# EAGLE design rcstick-f (EAGLE 9.3.0)
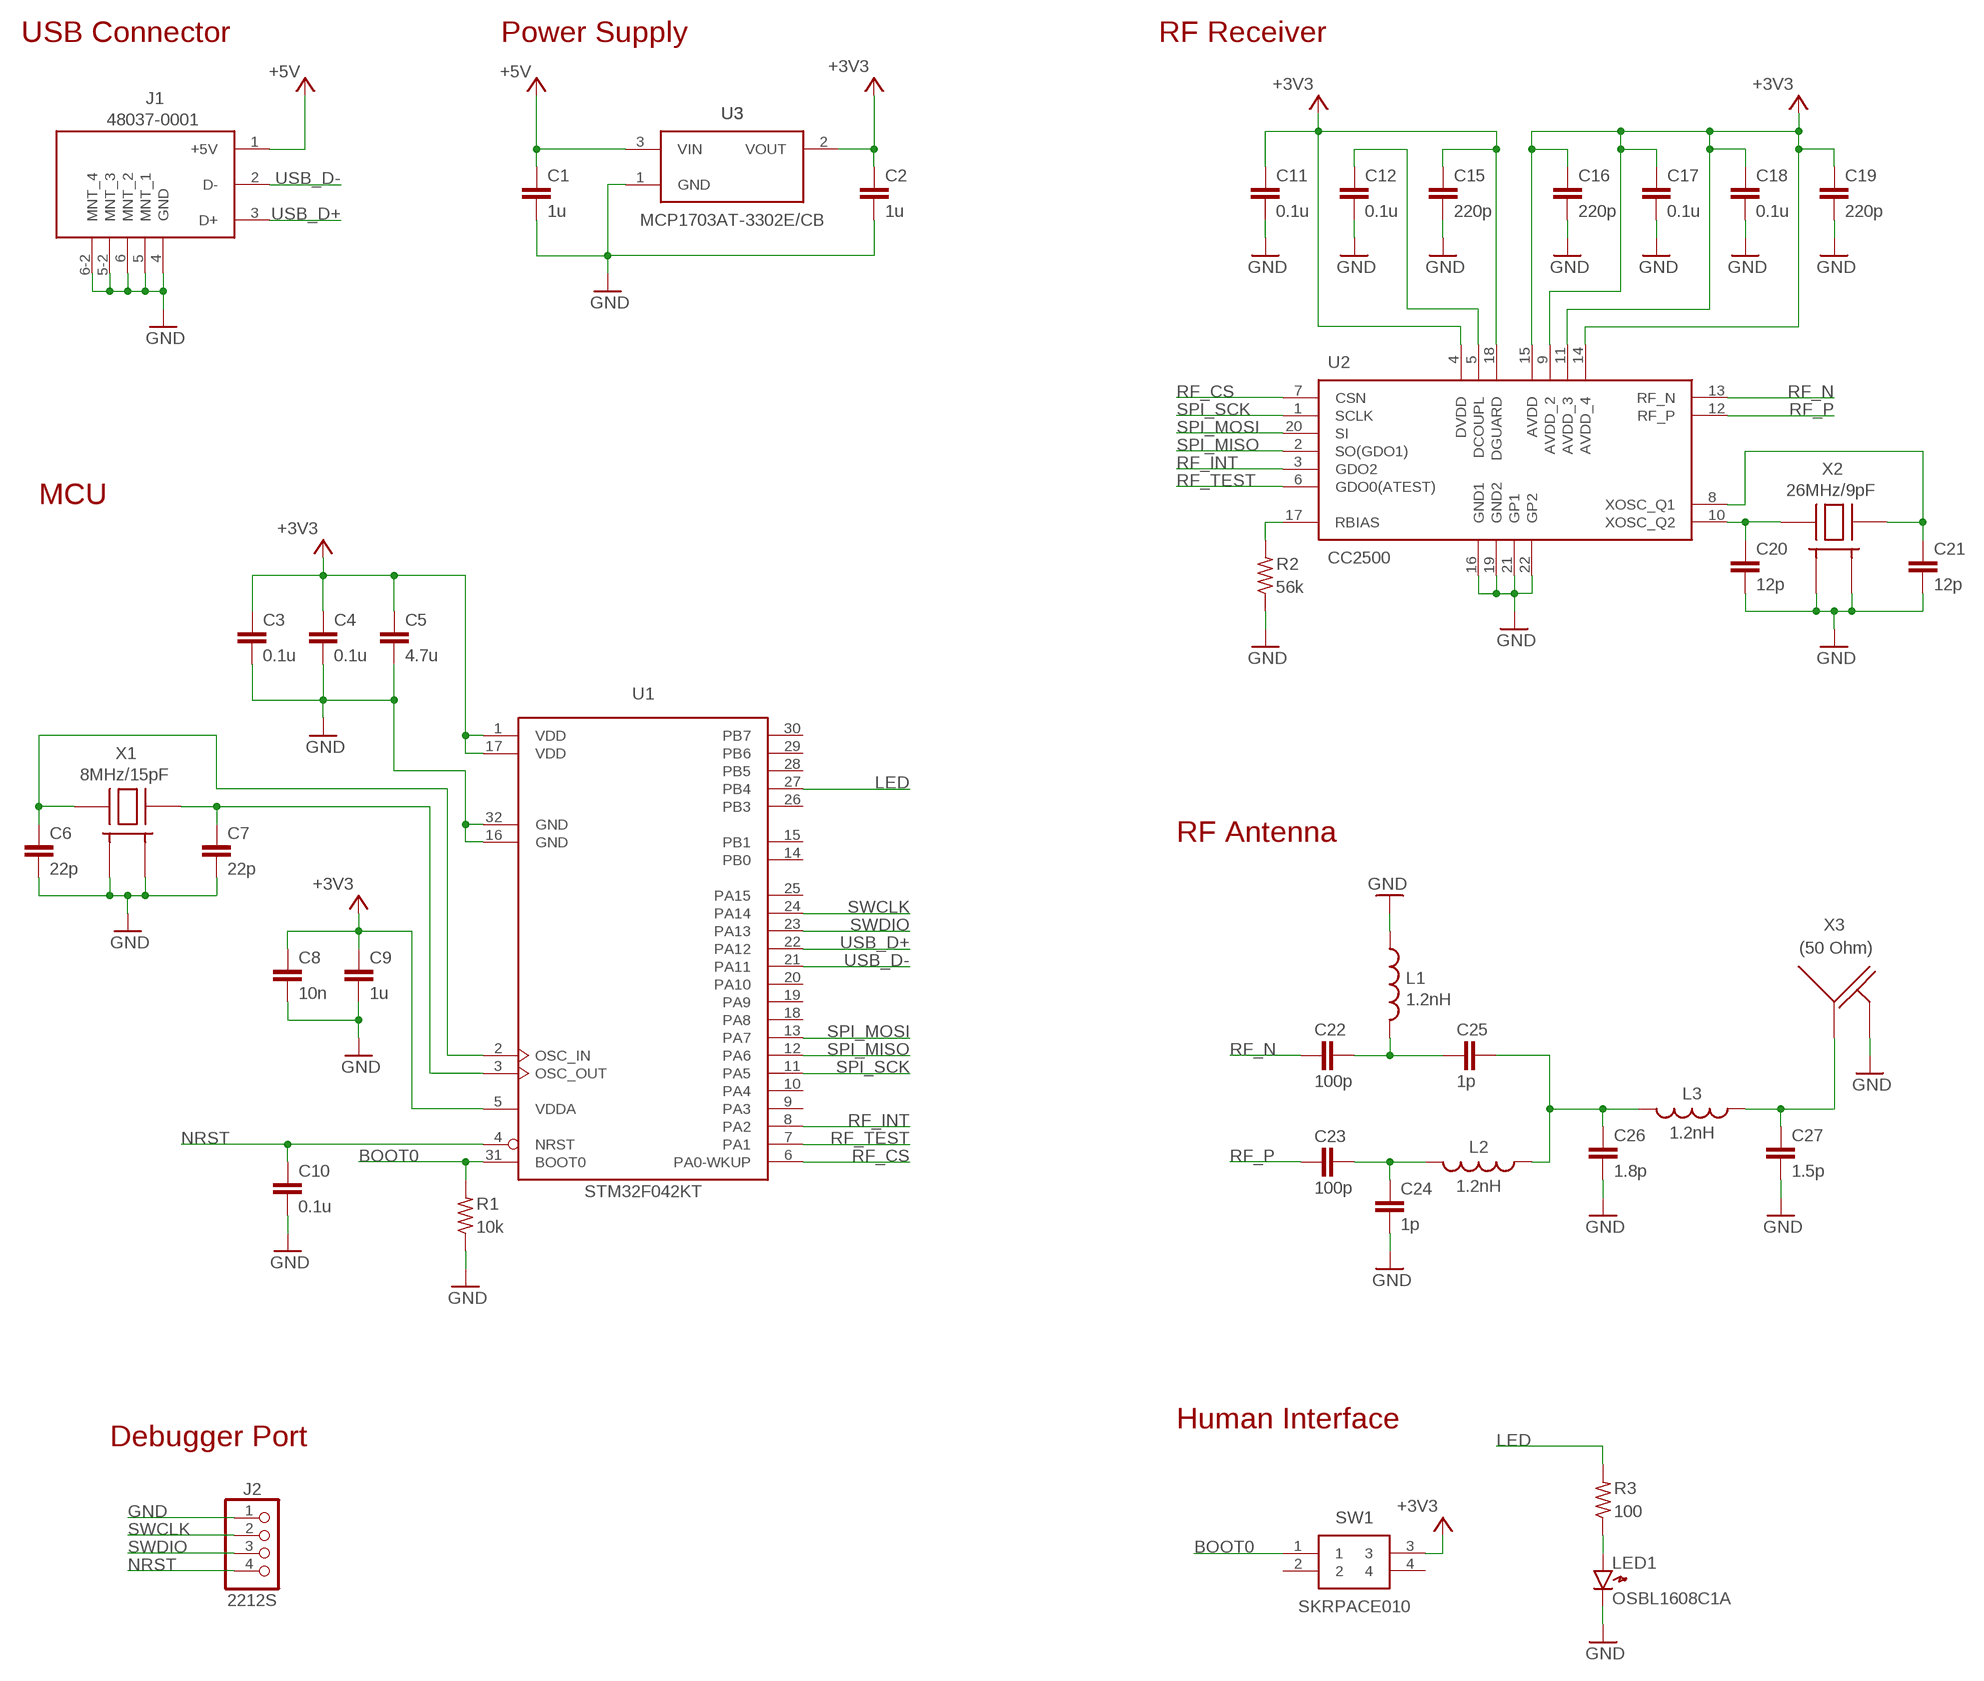
[diagram p0: schematic, sheet 1]

## Parts
C1  1u  RCL_C-EUC0402-HS  [RCL_C0402_HS]
C2  1u  RCL_C-EUC0402-HS  [RCL_C0402_HS]
C3  0.1u  RCL_C-EUC0402-HS  [RCL_C0402_HS]
C4  0.1u  RCL_C-EUC0402-HS  [RCL_C0402_HS]
C5  4.7u  RCL_C-EUC0402-HS  [RCL_C0402_HS]
C6  22p  RCL_C-EUC0402-HS  [RCL_C0402_HS]
C7  22p  RCL_C-EUC0402-HS  [RCL_C0402_HS]
C8  10n  RCL_C-EUC0402-HS  [RCL_C0402_HS]
C9  1u  RCL_C-EUC0402-HS  [RCL_C0402_HS]
C10  0.1u  RCL_C-EUC0402-HS  [RCL_C0402_HS]
C11  0.1u  RCL_C-EUC0402-HS  [RCL_C0402_HS]
C12  0.1u  RCL_C-EUC0402-HS  [RCL_C0402_HS]
C15  220p  RCL_C-EUC0402-HS  [RCL_C0402_HS]
C16  220p  RCL_C-EUC0402-HS  [RCL_C0402_HS]
C17  0.1u  RCL_C-EUC0402-HS  [RCL_C0402_HS]
C18  0.1u  RCL_C-EUC0402-HS  [RCL_C0402_HS]
C19  220p  RCL_C-EUC0402-HS  [RCL_C0402_HS]
C20  12p  RCL_C-EUC0402-HS  [RCL_C0402_HS]
C21  12p  RCL_C-EUC0402-HS  [RCL_C0402_HS]
C22  100p  RCL_C-EUC0402-HS  [RCL_C0402_HS]
C23  100p  RCL_C-EUC0402-HS  [RCL_C0402_HS]
C24  1p  RCL_C-EUC0402-HS  [RCL_C0402_HS]
C25  1p  RCL_C-EUC0402-HS  [RCL_C0402_HS]
C26  1.8p  RCL_C-EUC0402-HS  [RCL_C0402_HS]
C27  1.5p  RCL_C-EUC0402-HS  [RCL_C0402_HS]
J1  MOLEX_48037-0001  [MOLEX_48037-0001_1]
J2  2212S  CONNECTOR_STD-PINHD-1X4  [CONNECTOR_STD-1X4]
L1  1.2nH  RCL_L-USL0402-HS  [RCL_L0402_HS]
L2  1.2nH  RCL_L-USL0402-HS  [RCL_L0402_HS]
L3  1.2nH  RCL_L-USL0402-HS  [RCL_L0402_HS]
LED1  OSBL1608C1A  LED1608  [LED1608]
R1  10k  RCL_R-US_R0402-HS  [RCL_R0402_HS]
R2  56k  RCL_R-US_R0402-HS  [RCL_R0402_HS]
R3  100  RCL_R-US_R0402-HS  [RCL_R0402_HS]
SW1  SKRPACE010  [SMT(4.2X3.2)]
U1  STM32F042KT  [LQFP32-M]
U2  CC2500  CC2500-HS  [CC2500-RTY1_CC2500-HS]
U3  MCP1703AT-3302E/CB  LDO-REGULATOR  [SOT23]
X1  8MHz/15pF  CRYSTAL3225HS  [CRYSTAL3225-HS]
X2  26MHz/9pF  CRYSTAL3225HS  [CRYSTAL3225-HS]
X3  (50 Ohm)  2.4GHZ-INVERED-FLARGE-FLIP  [2.4GHZ-INVERTED-F-LARGE-FLIP]

## Nets
+3V3 [pwr]: C2.1 C3.1 C4.1 C5.1 C8.1 C9.1 C11.1 C15.1 C16.1 C17.1 C18.1 C19.1 SW1.3 U1.1(VDD) U1.5(VDDA) U1.17(VDD) U2.4(DVDD) U2.9(AVDD_2) U2.11(AVDD_3) U2.14(AVDD_4) U2.15(AVDD) U2.18(DGUARD) U3.2(VOUT)
+5V [pwr]: C1.1 J1.1(+5V) U3.3(VIN)
BOOT0: R1.2 SW1.1 U1.31(BOOT0)
DCOUPL: C12.1 U2.5(DCOUPL)
GND [gnd]: C1.2 C2.2 C3.2 C4.2 C5.2 C6.2 C7.2 C8.2 C9.2 C10.2 C11.2 C12.2 C15.2 C16.2 C17.2 C18.2 C19.2 C20.2 C21.2 C24.2 C26.2 C27.2 J1.4(GND) J1.5(MNT_1) J1.5-2(MNT_3) J1.6(MNT_2) J1.6-2(MNT_4) J2.1 L1.1 LED1.K R1.1 R2.1 U1.16(GND) U1.32(GND) U2.16(GND1) U2.19(GND2) U2.21(GP1) U2.22(GP2) U3.1(GND) X1.2(GND_1) X1.4(GND_2) X2.2(GND_1) X2.4(GND_2) X3.2(GND)
LED: R3.2 U1.27(PB4)
N$1: LED1.A R3.1
N$5: C22.2 C25.1 L1.2
N$9: C23.2 C24.1 L2.2
N$10: C25.2 C26.1 L2.1 L3.2
N$11: C27.1 L3.1 X3.1(ANT)
NRST: C10.1 J2.4 U1.4(NRST)
OSC_IN: C6.1 U1.2(OSC_IN) X1.1(HOT_1)
OSC_OUT: C7.1 U1.3(OSC_OUT) X1.3(HOT_2)
RBIAS: R2.2 U2.17(RBIAS)
RF_CS: U1.6(PA0-WKUP) U2.7(CSN)
RF_INT: U1.8(PA2) U2.3(GDO2)
RF_N: C22.1 U2.13(RF_N)
RF_P: C23.1 U2.12(RF_P)
RF_TEST: U1.7(PA1) U2.6(GDO0(ATEST))
SPI_MISO: U1.12(PA6) U2.2(SO(GDO1))
SPI_MOSI: U1.13(PA7) U2.20(SI)
SPI_SCK: U1.11(PA5) U2.1(SCLK)
SWCLK: J2.2 U1.24(PA14)
SWDIO: J2.3 U1.23(PA13)
USB_D+: J1.3(D+) U1.22(PA12)
USB_D-: J1.2(D-) U1.21(PA11)
XOSC1: C21.1 U2.8(XOSC_Q1) X2.3(HOT_2)
XOSC2: C20.1 U2.10(XOSC_Q2) X2.1(HOT_1)
Unconnected: SW1.2 SW1.4 U1.9(PA3) U1.10(PA4) U1.14(PB0) U1.15(PB1) U1.18(PA8) U1.19(PA9) U1.20(PA10) U1.25(PA15) U1.26(PB3) U1.28(PB5) U1.29(PB6) U1.30(PB7)

## Notes on the sheet
- USB Connector | Power Supply | RF Receiver
- MCU
- RF Antenna
- Human Interface
- Debugger Port

## Library data of the parts
C1-C12 C15-C27 = gen-discrete3:RCL_C-EU: CAPACITOR, European symbol
J1 = Molex - 48037-0001:MOLEX_48037-0001: Universal Serial Bus (USB) Shielded I/O Plug, Type A, Right Angle, Through Hole, 0.76µm Gold (Au) Plating, PCB Thickness 1.20mm-1.60mm, Lead-Free
J2 = connector2:CONNECTOR_STD-PINHD-1X4
L1-L3 = gen-discrete3:RCL_L-US: INDUCTOR, American symbol
LED1 = gen-discrete:LED: Generic LEDs
R1-R3 = gen-discrete3:RCL_R-US_: RESISTOR, American symbol
SW1 = SKRPACE010:SKRPACE010: Tactile Switches 4.2x3.2x2.5mm 260gf Source: Datasheet <http://www.alps.com/prod/info/E/HTML/Tact/SurfaceMount/SKRP/SKRPACE010.html>; ARROW_PART_NUMBER: SKRPACE010; DESCRIPTION: Tactile Switches 4.2x3.2x2.5mm 260gf; HEIGHT: mm; MANUFACTURER_NAME: ALPS; MANUFACTURER_PART_NUMBER: SKRPACE010
U1 = stm32:STM32F042K*T
U2 = CC2500:CC2500: RF Transceiver Source: Datasheet
U3 = SOT23_Module:LDO-REGULATOR
X1 X2 = CRYSTAL3225:CRYSTAL3225: Crystals 3225
X3 = antenna:2.4GHZ-INVERED-F

## Net classes
1 gnd: width 0.5 mm, drill 0.3 mm
2 pwr: width 0.2 mm, drill 0.3 mm

## Board
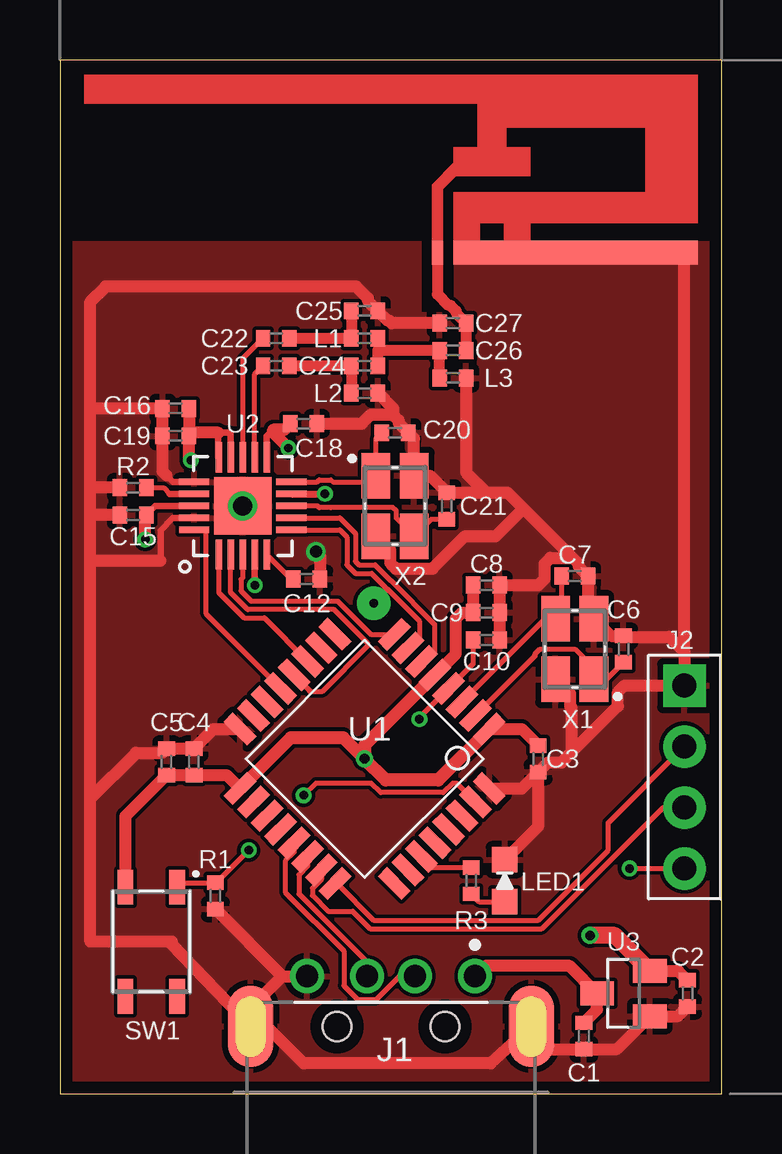
[diagram p1: board, top side]
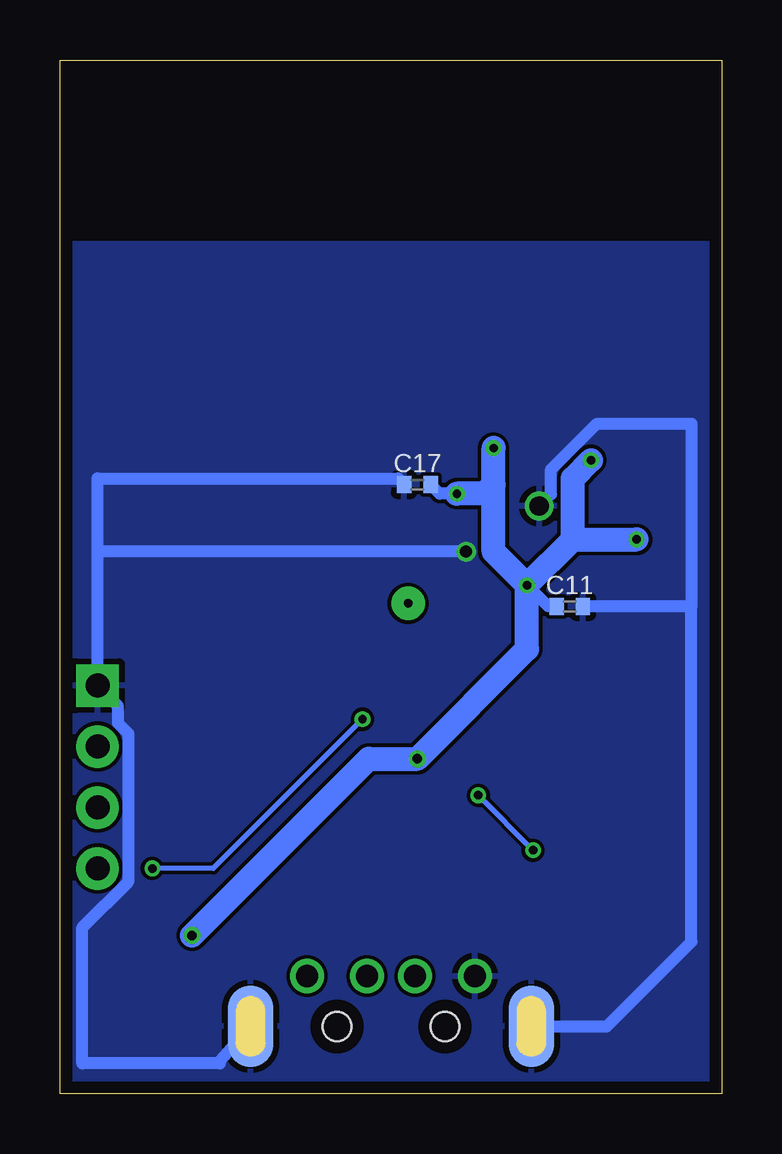
[diagram p2: board, bottom side, seen from below]

Size 27.6 x 43.1 mm. Coordinates in mm from the lower left corner, seen from the top.
Outline: 0,0 27.6,0 27.6,43.1 0,43.1 0,0
Copper layers (1*16): Top 0.035mm / dielectric 1.6mm / Bottom 0.035mm
Design rules "Elecrow_2-layer_PCB_eagle_rule": minimum track width 6mil, minimum drill 12mil, track to track 6mil, track to pad 6mil, pad to pad 6mil, via to via 8mil, smd to smd 0mil, copper to edge 20mil, drill to drill 10mil, minimum pad ring 6mil, minimum via ring 6mil, stop-mask expansion 0mil, vias tented up to drill 100mil, thermal gap 10mil

### Footprints (pad centres in the part's own frame; a part is rotated, then mirrored left to right if it is on the bottom)
RCL_C0402_HS = smd 0.6 x 0.7: 1 -0.55,0; 2 0.55,0
MOLEX_48037-0001_1 = drill 0.93 pad 1.42: 1 3.5,10.5; 2 1,10.5; 3 -1,10.5; 4 -3.5,10.5 | smd 1.9 x 3.4: 5 -5.85,8.4; 6 5.85,8.4 | smd 1.9 x 3.4 bottom: 5-2 -5.85,8.4; 6-2 5.85,8.4 | hole 1.2: -2.25,8.4; 2.25,8.4
CONNECTOR_STD-1X4 = drill 1 pad 1.778 square: 1 -6.35,0 | drill 1 pad 1.778: 2 -3.81,0; 3 -1.27,0; 4 1.27,0
RCL_L0402_HS = smd 0.6 x 0.7: 1 -0.55,0; 2 0.55,0
LED1608 = smd 1.05 x 1.08: A -0.875,0; K 0.875,0
RCL_R0402_HS = smd 0.6 x 0.7: 1 -0.55,0; 2 0.55,0
SMT(4.2X3.2) = smd 1.45 x 0.65: 1 -2.275,1.075; 2 2.275,1.075; 3 -2.275,-1.075; 4 2.275,-1.075
LQFP32-M = smd 0.54 x 1.4: 1 -2.8,-4.55; 2 -2,-4.55; 3 -1.2,-4.55; 4 -0.4,-4.55; 5 0.4,-4.55; 6 1.19,-4.55; 7 1.99,-4.55; 8 2.79,-4.55; 17 2.8,4.55; 18 2,4.55; 19 1.2,4.55; 20 0.4,4.55; 21 -0.4,4.55; 22 -1.2,4.55; 23 -2,4.55; 24 -2.8,4.55 | smd 1.4 x 0.54: 9 4.55,-2.8; 10 4.55,-2; 11 4.55,-1.2; 12 4.55,-0.4; 13 4.55,0.4; 14 4.55,1.2; 15 4.55,2; 16 4.55,2.8; 25 -4.55,2.8; 26 -4.55,2; 27 -4.55,1.2; 28 -4.55,0.4; 29 -4.55,-0.4; 30 -4.55,-1.2; 31 -4.55,-2; 32 -4.55,-2.8
CC2500-RTY1_CC2500-HS = smd 1.26 x 0.28: 1 -2.03,1; 2 -2.03,0.5; 3 -2.03,0; 4 -2.03,-0.5; 5 -2.03,-1; 11 2.03,-1; 12 2.03,-0.5; 13 2.03,0; 14 2.03,0.5; 15 2.03,1 | smd 0.28 x 1.26: 6 -1,-2.03; 7 -0.5,-2.03; 8 0,-2.03; 9 0.5,-2.03; 10 1,-2.03; 16 1,2.03; 17 0.5,2.03; 18 0,2.03; 19 -0.5,2.03; 20 -1,2.03 | smd 2.4 x 2.4: 21 0,0 | drill 0.8: 22 0,0
SOT23 = smd 1 x 1.4: 1 -0.95,-1.1; 2 0.95,-1.1; 3 0,1.1
CRYSTAL3225-HS = smd 1.9 x 1.2: 1 -1.26,-0.8; 2 1.26,-0.8; 3 1.26,0.8; 4 -1.26,0.8
2.4GHZ-INVERTED-F-LARGE-FLIP = smd 0.46 x 1: 1 -10.86,-0.5 | smd 10.18 x 1: 2 -5.09,-0.5

### Placement (x,y rotation side)
C1  21.84,2.41 270 top
C2  26.16,4.19 270 top
C3  19.94,13.97 270 top
C4  5.59,13.84 90 top
C5  4.45,13.84 90 top
C6  23.5,18.54 90 top
C7  21.46,21.59 0 top
C8  17.78,21.21 0 top
C9  17.78,20.07 0 top
C10  17.78,18.92 0 top
C11  6.35,20.32 0 bottom
C12  10.29,21.46 0 top
C15  3.05,24.13 180 top
C16  4.83,28.57 180 top
C17  12.7,25.4 180 bottom
C18  10.16,27.94 0 top
C19  4.83,27.43 180 top
C20  13.97,27.56 0 top
C21  16.13,24.51 90 top
C22  9.02,31.5 0 top
C23  9.02,30.35 0 top
C24  12.7,29.21 0 top
C25  12.7,31.5 0 top
C26  16.38,29.84 0 top
C27  16.38,32.13 180 top
J1  13.8,-5.59 0 top
J2  26.04,10.67 270 top
L1  12.7,32.64 180 top
L2  12.7,30.35 180 top
L3  16.38,30.99 180 top
LED1  18.54,8.89 90 top
R1  6.48,8.26 90 top
R2  3.05,25.27 0 top
R3  17.14,8.89 90 top
SW1  3.81,6.35 270 top
U1  12.7,13.97 135 top
U2  7.62,24.51 90 top
U3  23.5,4.19 90 top
X1  21.46,18.54 90 top
X2  13.97,24.51 270 top
X3  26.59,35.57 0 top

### Tracks (layer width: path | path; a pad name or v marks a point on that pad's centre or on a via)
+3V3  (via drill 0.35, 0.4)
  Top 0.27: U2.15 6.6,26.56 6.6,27.56 7.11,27.56 7.12,27.55 U2.14 | U2.11 8.62,27.42 8.89,27.69 | U2.18 3.98,24.51 C15.1 | U2.4 v8.12,21.22 v8.13,21.21
  Top 0.3: U2.9 v11.04,25.01 v11.05,25.02
  Top 0.5: U3.2 25.76,5.14 C2.1 | U1.17 6.94,13.29 C4.1 C5.1 2.73,11.58 SW1.3 | U1.1 19.25,15.21 C3.1 | U1.5 16.51,18.35 16.51,19.81 16.76,20.07 C9.1 C8.1 | C16.1 C19.1 | v5.46,26.42 5.38,26.5 C19.1 | v3.56,23.11 3.56,24.09 C15.1 | v9.53,26.92 8.89,27.56 8.89,27.69 9.36,27.69 C18.1 | 6.6,27.56 5.5,27.56 C19.1
  Top 0.54: U1.5 12.7,14.54 v12.7,13.97 | U1.1 15.77,13.08 13.59,13.08 v12.7,13.97 | U1.17 9.63,14.86 11.81,14.86 v12.7,13.97
  Top 0.7: U3.2 23.13,6.6 v22.1,6.6
  Bottom 0.5: v11.05,25.02 11.77,25.02 C17.1 | C11.1 7.24,20.32 v8.13,21.21
  Bottom 1: v22.1,6.6 14.73,13.97 v12.7,13.97 8.13,18.54 v8.13,21.21 | v8.13,21.21 6.22,23.11 | 6.22,23.11 v3.56,23.11 | 6.22,23.11 6.22,25.65 v5.46,26.42 | v8.13,21.21 9.53,22.61 9.53,25.4 | 9.53,25.4 v9.53,26.92 | 9.53,25.4 9.91,25.02 v11.05,25.02
+5V
  Top 0.5: C1.1 22.39,3.51 U3.3 21.25,5.33 17.72,5.33 J1.1
BOOT0  (via drill 0.35)
  Top 0.2: U1.31 16.54,12.95 16.38,12.95 15.99,12.56 13.37,12.56 12.98,12.95 10.67,12.95 v10.16,12.45 | v7.87,10.16 6.52,8.8 R1.2 5.07,8.8 SW1.1
  Bottom 0.2: v10.16,12.45 v7.87,10.16
DCOUPL
  Top 0.2: U2.5 9.64,21.46 C12.1
GND  (via drill 0.5)
  Top 0.27: U2.16 4.71,25.51 4.45,25.78 | U2.19 4.71,24.01 4.19,23.5 4.19,22.23
  Top 0.5: C2.2 25.76,3.24 U3.1 23.22,1.86 C1.2 20.45,1.86 J1.6 17.96,1.27 10.16,1.27 8.62,2.81 J1.5 | C10.2 C9.2 C8.2 19.94,21.21 20.21,21.48 20.21,22.11 20.45,22.34 21.38,22.34 | LED1.K 19.94,11.16 C3.2 | U1.32 19.25,12.73 C3.2 | C3.2 20.34,13.82 20.92,13.82 21.33,14.23 | U1.16 6.4,15.21 C4.2 C5.2 4.28,14.22 3.17,14.22 1.27,12.32 | R1.1 9.27,4.91 | 9.27,4.91 J1.4 | 1.27,12.32 1.27,6.35 4.66,6.35 4.66,6.25 J1.5 | 26.04,18.41 25.4,19.05 23.54,19.05 C6.2 22.97,19.09 X1.2 22.01,20.05 C7.2 21.61,21.99 21.61,22.11 21.38,22.34 | 26.04,18.41 J2.1 23.54,17.02 23.27,16.75 23.27,16.16 21.33,14.23 | 1.27,12.32 1.27,22.23 | 1.27,22.23 1.27,24.13 | 1.27,24.13 1.27,25.27 | 1.27,25.27 1.27,28.7 | X1.4 21.26,16.68 21.26,16.16 21.33,16.1 21.33,14.23 | 4.19,22.23 1.27,22.23 | 1.27,28.7 1.4,28.57 C16.2 C19.2 4.28,25.95 4.45,25.78 | R2.1 1.27,25.27 | C15.2 1.27,24.13 | 13.89,28.31 12.95,28.31 12.58,27.94 C18.2 | 13.89,28.31 14.12,28.08 14.12,27.96 C20.2 14.77,27.31 X2.4 15.42,25.77 C21.2 17.78,25.06 | 19.32,24.4 18.66,25.06 17.78,25.06 | 19.32,24.4 21.38,22.34 | 19.32,24.4 18.17,23.25 16.89,23.25 15.54,21.9 14,21.9 13.77,22.13 13.77,22.65 X2.2 | 1.27,28.7 1.27,33.02 1.91,33.66 12.35,33.66 12.85,33.16 12.85,33.04 L1.1 13.64,32.25 13.72,32.25 13.83,32.13 C27.2 | C26.2 16.93,25.91 17.78,25.06 | C24.2 13.89,28.57 13.89,28.31 | v10.67,22.61 10.84,22.44 C12.2 | 26.04,18.41 26.04,34.92 25.64,35.32 21.75,35.32 X3.2 | J1.5 8.1,3.74 9.27,4.91
  Bottom 0.5: 1.27,20.32 1.27,6.35 4.81,2.81 J1.5 | 1.27,20.32 C11.2 | 26.04,22.61 J2.1 25.18,16.17 25.18,15.46 24.74,15.01 24.74,8.86 26.67,6.94 26.67,1.27 20.94,1.27 20.94,1.37 J1.6 | 26.04,22.61 26.04,25.65 13.5,25.65 C17.2 | U2.22 7.12,25.01 7.12,26.03 5.21,27.94 1.27,27.94 1.27,20.32 | v10.67,22.61 26.04,22.61
  pour Bottom: 0,-1.27 -1.27,0 -1.27,35.56 29.21,35.56 29.21,0 27.94,-1.27
  pour Top: 27.69,35.56 16.52,35.56 16.52,32.49 14.99,32.49 14.99,35.56 0,35.56 0,0 27.56,0 27.56,35.43
LED
  Top 0.2: U1.27 15.53,9.44 R3.2
N$1
  Top 0.2: R3.1 17.47,8.02 LED1.A
N$5
  Top 0.46: C22.2 C25.1 L1.2
N$9
  Top 0.46: C23.2 L2.2 C24.1
N$10
  Top 0.2: 13.25,30.99 C25.2
  Top 0.46: C26.1 L3.2 13.25,30.99 L2.1
N$11
  Top 0.46: L3.1 C27.1 16.52,32.55 16.52,32.64 16.29,32.86 16.2,32.86 15.73,33.33 X3.1
NRST  (via drill 0.35)
  Top 0.2: C10.1 17.23,17.93 U1.4 14.99,15.69 v14.99,15.62 | v23.75,9.4 J2.4
  Bottom 0.2: v14.99,15.62 21.21,9.4 v23.75,9.4
OSC_IN
  Top 0.2: U1.2 19.81,18.25 19.81,18.34 20.02,18.54 21.46,18.54 22.26,17.74 X1.1 22.79,17.28 C6.1
OSC_OUT
  Top 0.2: U1.3 20.23,19.8 X1.3 20.91,20.05 C7.1
RBIAS
  Top 0.2: R2.2 4.32,25.27 4.58,25.01
  Top 0.27: 4.58,25.01 U2.17
RF_CS
  Top 0.2: U2.7 11.68,24.01 12.32,23.37 12.32,22.2 12.46,22.05 13.14,22.05 13.79,21.41 13.79,21.4 15.62,19.57 15.62,18.41 15.46,18.41 U1.6
RF_INT
  Top 0.2: U1.8 12.96,19.16 11.58,20.55 7.97,20.55 7.55,20.97 7.55,21.45 7.62,21.52 U2.3
RF_N
  Top 0.2: C22.1 7.62,30.65 U2.13
RF_P
  Top 0.2: U2.12 8.12,30.01 C23.1
RF_TEST  (via drill 0.35 pad 1.4)
  Top 0.2: U2.6 11.67,23.51 11.96,23.21 11.96,22.05 12.32,21.7 13,21.7 13.54,21.16 13.65,21.04 | v13.08,20.45 13.65,21.02 13.65,21.04 | 13.65,21.04 14.99,19.71 14.99,18.92 14.84,18.92 U1.7
SPI_MISO
  Top 0.2: U1.12 10.41,16.82 10.41,16.76 10.92,16.76 12.83,18.67 12.83,18.8 11.43,20.19 7.83,20.19 7.12,20.9 U2.2
SPI_MOSI
  Top 0.2: U1.13 6.1,20.01 6.1,23.5 5.61,23.5 U2.20
SPI_SCK
  Top 0.2: U2.1 6.62,20.9 7.68,19.84 8.53,19.84 U1.11
SWCLK
  Top 0.2: U1.24 11.55,8.77 13.08,7.24 19.94,7.24 22.86,10.16 22.86,11.3 J2.2
SWDIO
  Top 0.2: U1.23 10.9,8.95 10.52,8.57 10.52,8.27 11.18,7.62 12.2,7.62 12.94,6.88 20.09,6.88 25.15,11.94 J2.3
USB_D+
  Top 0.2: U1.22 10.33,9.51 9.96,9.14 9.96,8.34 12.8,5.5 J1.3
USB_D-
  Top 0.2: U1.21 9.77,10.08 9.39,9.71 9.39,8.41 11.84,5.96 11.84,4.51 12.4,3.95 13.2,3.95 14.16,4.91 J1.2
XOSC1
  Top 0.2: U2.8 10.74,24.51 10.81,24.44 11.29,24.44 11.3,24.45 13.88,24.45 14.02,24.31 14.02,24 X2.3 15.48,23.96 C21.1
XOSC2
  Top 0.2: U2.10 10.72,25.51 10.81,25.6 11.29,25.6 11.38,25.51 12.91,25.51 X2.1 13.17,27.31 C20.1